# Altium schematic sheet top_level.SchDoc
size A4
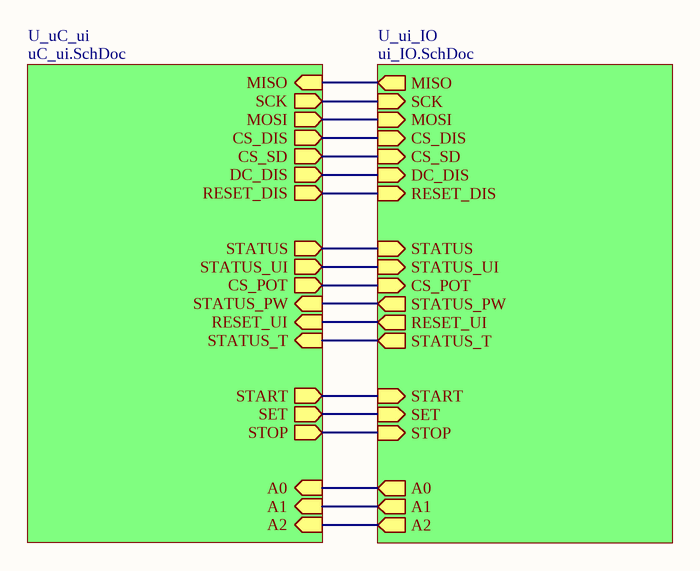
[diagram p0: top_level.SchDoc]

## Sub-sheets
U_uC_ui = uC_ui.SchDoc: A0 (in), A1 (in), A2 (in), CS_SD (out), STATUS_UI (out), STATUS_PW (in), CS_DIS (out), MOSI (out), MISO (in), SCK (out), STATUS_T (in), STATUS (out), SET (out), START (out), STOP (out), CS_POT (out), RESET_DIS (out), DC_DIS (out), RESET_UI (in)
U_ui_IO = ui_IO.SchDoc: MISO (out), RESET_DIS (in), DC_DIS (in), CS_DIS (in), A0 (out), A1 (out), START (in), STOP (in), STATUS_PW (out), STATUS_UI (in), RESET_UI (out), STATUS_T (out), STATUS (in), SET (in), CS_SD (in), CS_POT (in), SCK (in), MOSI (in), A2 (out)

## Nets
(unnamed): sheet U_uC_ui/A0, sheet U_ui_IO/A0
(unnamed): sheet U_uC_ui/A1, sheet U_ui_IO/A1
(unnamed): sheet U_uC_ui/A2, sheet U_ui_IO/A2
(unnamed): sheet U_uC_ui/CS_SD, sheet U_ui_IO/CS_SD
(unnamed): sheet U_uC_ui/STATUS_UI, sheet U_ui_IO/STATUS_UI
(unnamed): sheet U_uC_ui/STATUS_PW, sheet U_ui_IO/STATUS_PW
(unnamed): sheet U_uC_ui/CS_DIS, sheet U_ui_IO/CS_DIS
(unnamed): sheet U_uC_ui/MOSI, sheet U_ui_IO/MOSI
(unnamed): sheet U_uC_ui/MISO, sheet U_ui_IO/MISO
(unnamed): sheet U_uC_ui/SCK, sheet U_ui_IO/SCK
(unnamed): sheet U_uC_ui/STATUS_T, sheet U_ui_IO/STATUS_T
(unnamed): sheet U_uC_ui/STATUS, sheet U_ui_IO/STATUS
(unnamed): sheet U_uC_ui/SET, sheet U_ui_IO/SET
(unnamed): sheet U_uC_ui/START, sheet U_ui_IO/START
(unnamed): sheet U_uC_ui/STOP, sheet U_ui_IO/STOP
(unnamed): sheet U_uC_ui/CS_POT, sheet U_ui_IO/CS_POT
(unnamed): sheet U_uC_ui/RESET_DIS, sheet U_ui_IO/RESET_DIS
(unnamed): sheet U_uC_ui/DC_DIS, sheet U_ui_IO/DC_DIS
(unnamed): sheet U_uC_ui/RESET_UI, sheet U_ui_IO/RESET_UI